# EAGLE design SD2IEC (EAGLE 6.6.0)
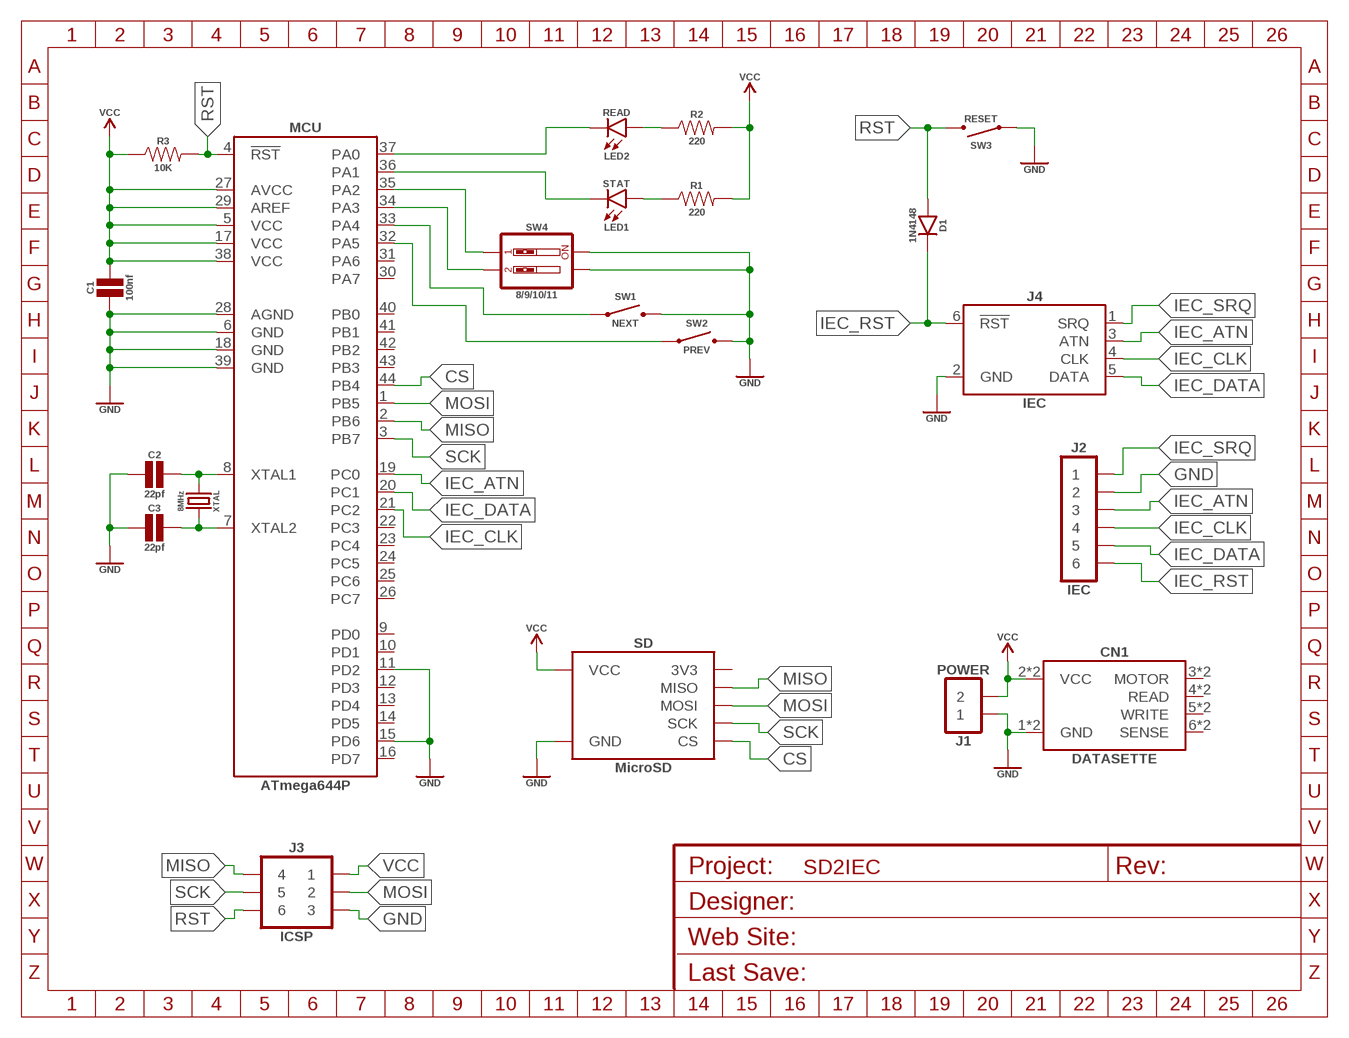
[diagram p0: schematic, sheet 1]
FRAME1 (A5L_FRAME): DESIGNER: Simon/CGTr; REVISION: 1.0; WEBSITE: http://www.commodore.gen.tr

## Parts
C1  100nf  CAPACITOR_CERAMIC_1206  [CAPACITOR_CERAMIC_1206]
C2  22pf  CAPACITOR_CERAMIC_1206  [CAPACITOR_CERAMIC_1206]
C3  22pf  CAPACITOR_CERAMIC_1206  [CAPACITOR_CERAMIC_1206]
CN1  DATASETTE  C64_DATASETTE_PADS  [C64_DATASETTE_PADS]
D1  1N4148  DIODE_NORMAL_LL4148  [DIODE_NORMAL_SMT]
J1  POWER  HDR_1X02  [HDR_1X02]
J2  IEC  HDR_1X06  [HDR_1X06]
J3  ICSP  HDR_2X03  [HDR_2X03]
J4  IEC  C64_IEC  [C64_IEC_DIN6]
LED1  STAT  LED_NORMAL_1206  [LED_1206]
LED2  READ  LED_NORMAL_1206  [LED_1206]
MCU  ATmega644P  ATMEGA644P-20AU  [TQFP44]
R1  220  RESISTOR_SMT_1206  [RESISTOR_1206]
R2  220  RESISTOR_SMT_1206  [RESISTOR_1206]
R3  10K  RESISTOR_SMT_1206  [RESISTOR_1206]
SD  MicroSD  MICROSD_RTL  [MICROSD_RTL]
SW1  NEXT  SWITCH_THT_SIDE  [SWITCH_THT_SIDE]
SW2  PREV  SWITCH_THT_SIDE  [SWITCH_THT_SIDE]
SW3  RESET  SWITCH_THT_SIDE  [SWITCH_THT_SIDE]
SW4  8/9/10/11  SWITCH_DIP_02  [SWITCH_DIP_02]
XTAL  8MHz  XTAL_5032  [XTAL_5032]

## Nets
8/9: MCU.35(PA2) SW4.1
10/11: MCU.34(PA3) SW4.2
CS: MCU.44(PB4) SD.CS
GND: C1.1 C2.1 C3.1 CN1.1(GND) CN1.A(GND) J1.1 J2.2 J3.3 J4.2(GND) MCU.6(GND) MCU.11(PD2) MCU.15(PD6) MCU.18(GND) MCU.28(AGND) MCU.39(GND) SD.GND SW1.2 SW2.2 SW3.1 SW4.3 SW4.4
IEC_ATN: J2.3 J4.3(ATN) MCU.19(PC0)
IEC_CLK: J2.4 J4.4(CLK) MCU.21(PC2)
IEC_DATA: J2.5 J4.5(DATA) MCU.20(PC1)
IEC_RST: D1.C(CATHODE) J2.6 J4.6(!RST)
IEC_SRQ: J2.1 J4.1(SRQ)
MISO: J3.4 MCU.2(PB6) SD.MISO
MOSI: J3.2 MCU.1(PB5) SD.MOSI
NEXT: MCU.33(PA4) SW1.1
PREV: MCU.32(PA5) SW2.1
READ: LED2.C MCU.37(PA0)
READ1: LED2.A R2.1
RST: D1.A(ANODE) J3.6 MCU.4(!RST) R3.2 SW3.2
SCK: J3.5 MCU.3(PB7) SD.SCK
SELECT: LED1.C MCU.36(PA1)
SELECT1: LED1.A R1.1
VCC: C1.2 CN1.2(VCC) CN1.B(VCC) J1.2 J3.1 MCU.5(VCC) MCU.17(VCC) MCU.27(AVCC) MCU.29(AREF) MCU.38(VCC) R1.2 R2.2 R3.1 SD.VCC
XTAL1: C2.2 MCU.8(XTAL1) XTAL.1
XTAL2: C3.2 MCU.7(XTAL2) XTAL.2
Unconnected: CN1.3(MOTOR) CN1.4(READ) CN1.5(WRITE) CN1.6(SENSE) CN1.C(MOTOR) CN1.D(READ) CN1.E(WRITE) CN1.F(SENSE) MCU.9(PD0) MCU.10(PD1) MCU.12(PD3) MCU.13(PD4) MCU.14(PD5) MCU.16(PD7) MCU.22(PC3) MCU.23(PC4) MCU.24(PC5) MCU.25(PC6) MCU.26(PC7) MCU.30(PA7) MCU.31(PA6) MCU.40(PB0) MCU.41(PB1) MCU.42(PB2) MCU.43(PB3) SD.3V3

## Library data of the parts
C1-C3 = sj_standart:CAPACITOR_CERAMIC: Ceramic Capacitor
CN1 = sj_commodore:C64_DATASETTE: C64 Datasette Pads
D1 = sj_standart:DIODE_NORMAL: Standart Small Signal and Rectifier Diodes
J1 = sj_connectors:HDR_1X02: 1x02 - 0.1" Pin Header
J2 = sj_connectors:HDR_1X06: 1x06 - 0.1" Pin Header
J3 = sj_connectors:HDR_2X03: 2x03 - 0.1" Pin Header
J4 = sj_commodore:C64_IEC: C64 IEC Connector
LED1 LED2 = sj_standart:LED_NORMAL: Standard LED
MCU = sj_mcu:ATMEGA644P: ATmega644P MCU - 64 KB FLASH, 4 KB SRAM, 2 KB EEPROM
R1-R3 = sj_standart:RESISTOR: Resistor
SD = sj_arduino:MICROSD: MicroSD Card Module
SW1-SW3 = sj_standart:SWITCH_THT: Switch (Through Hole Technology)
SW4 = sj_standart:SWITCH_DIP_02: 2-bit DIP Switch
XTAL = sj_mcu:XTAL: Crystal Oscillator

## Board
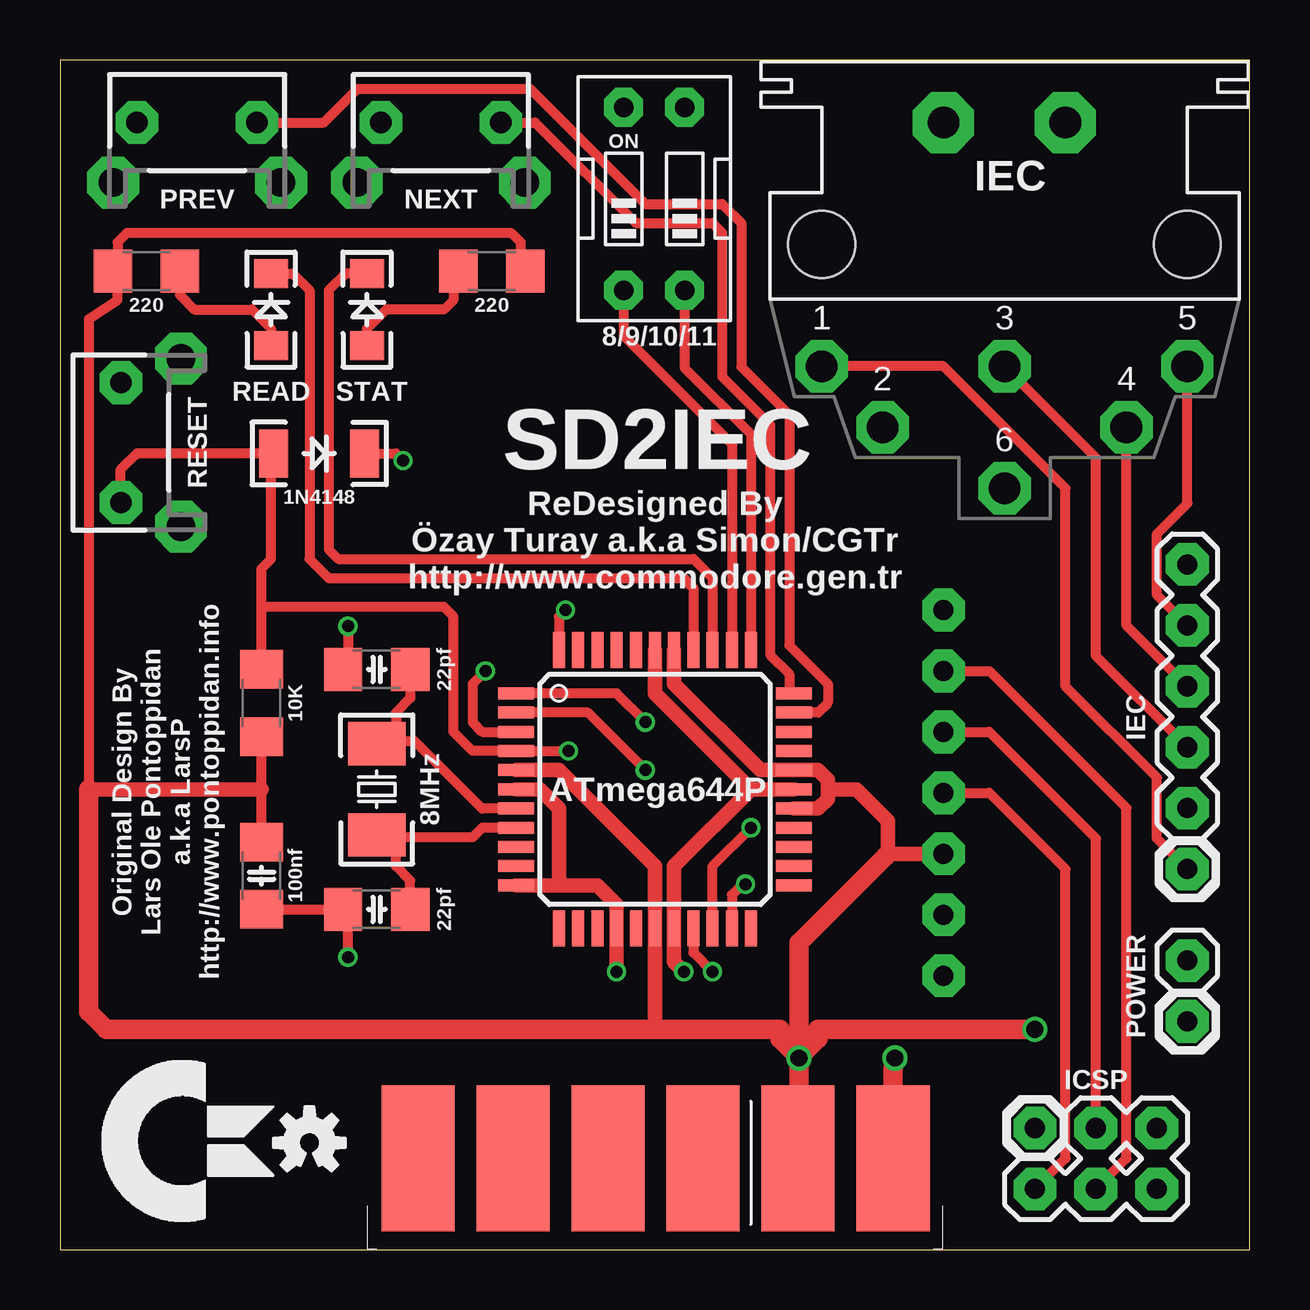
[diagram p1: board, top side]
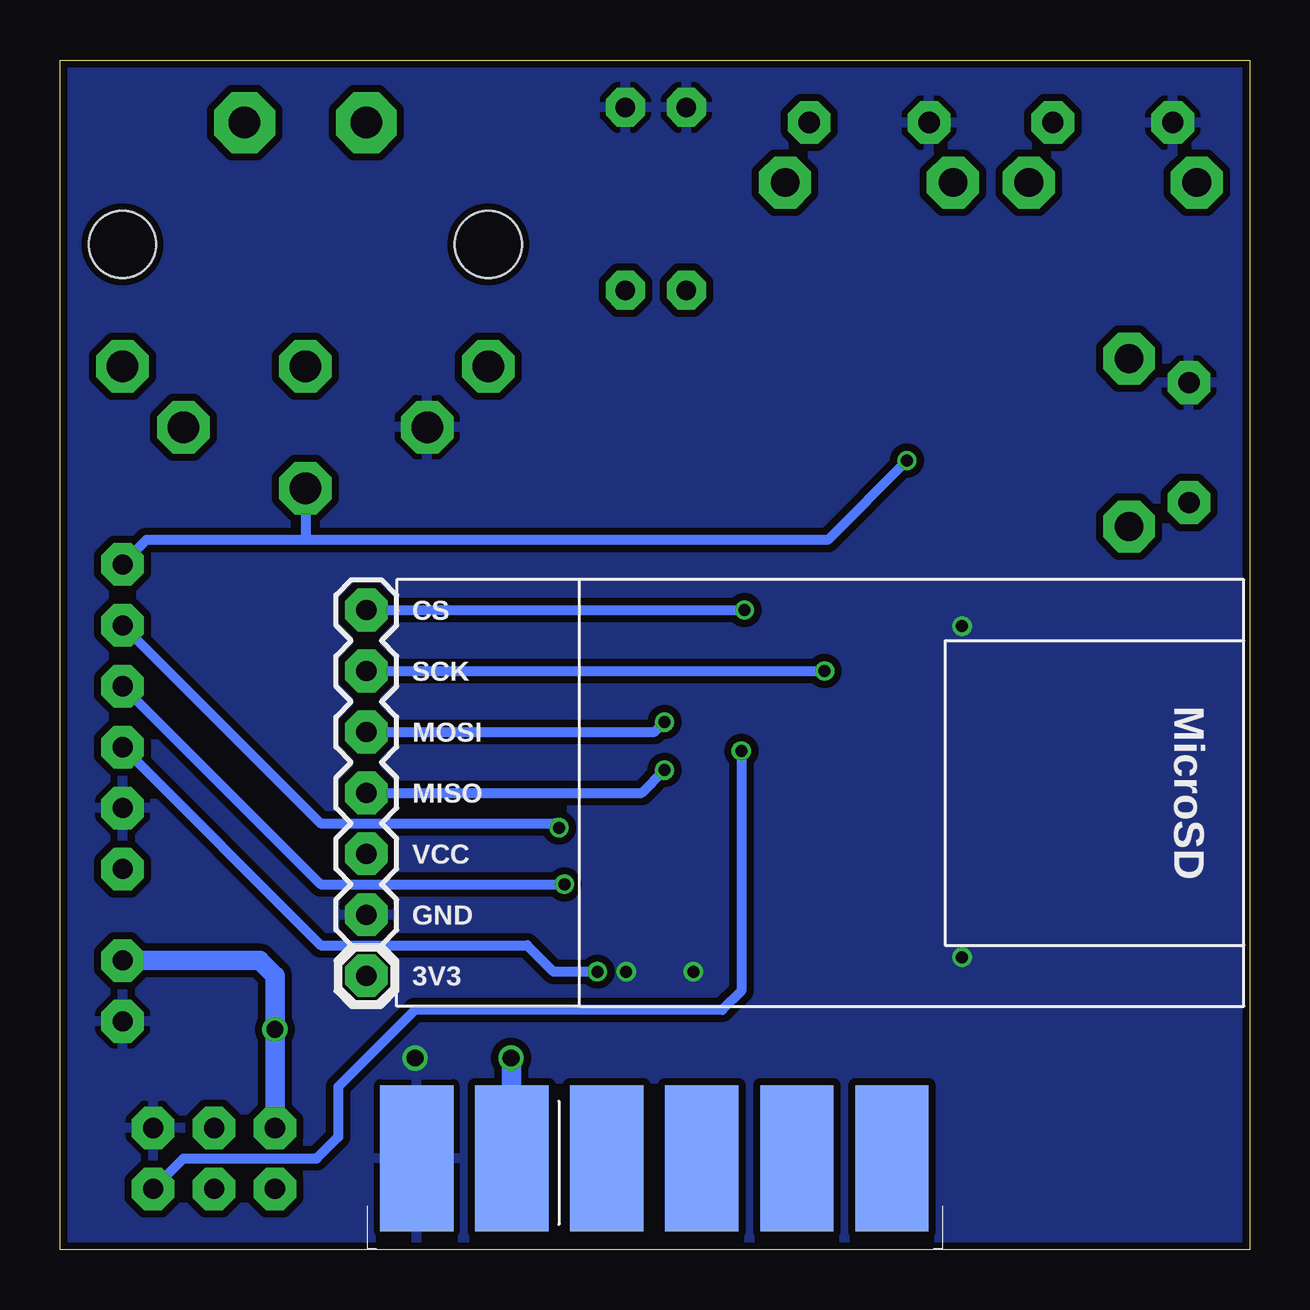
[diagram p2: board, bottom side, seen from below]

Size 49.6 x 49.6 mm. Coordinates in mm from the lower left corner, seen from the top.
Outline: 0,0 49.6,0 49.6,49.6 0,49.6 0,0
Copper layers (1*16): Top 0.035mm / dielectric 1.5mm / Bottom 0.035mm
Design rules "DirtyPCBs": minimum track width 5mil, minimum drill 12mil, track to track 5mil, track to pad 5mil, pad to pad 5mil, via to via 5mil, smd to smd 0mil, copper to edge 10mil, drill to drill 10mil, minimum pad ring 10mil, minimum via ring 6mil, stop-mask expansion 2mil, vias tented up to drill 25mil, thermal gap 10mil

### Footprints (pad centres in the part's own frame; a part is rotated, then mirrored left to right if it is on the bottom)
CAPACITOR_CERAMIC_1206 = smd 1.6 x 1.8: 1 -1.4,0; 2 1.4,0
C64_DATASETTE_PADS = smd 3.048 x 6.096: 1 9.927,-3.781; 2 5.967,-3.781; 3 2.007,-3.781; 4 -1.953,-3.781; 5 -5.913,-3.781; 6 -9.873,-3.781 | smd 3.048 x 6.096 bottom: A 9.927,-3.781; B 5.967,-3.781; C 2.007,-3.781; D -1.953,-3.781; E -5.913,-3.781; F -9.873,-3.781
DIODE_NORMAL_SMT = smd 1.2 x 2: A -1.9,0; C 1.9,0
HDR_1X02 = drill 0.838 pad 1.778 octagon: 1 0,0; 2 2.54,0
HDR_1X06 = drill 0.838 pad 1.778 octagon: 1 0,0; 2 2.54,0; 3 5.08,0; 4 7.62,0; 5 10.16,0; 6 12.7,0
HDR_2X03 = drill 0.838 pad 1.778 octagon: 1 0,0; 2 2.54,0; 3 5.08,0; 4 0,-2.54; 5 2.54,-2.54; 6 5.08,-2.54
C64_IEC_DIN6 = drill 1.321 pad 2.184 octagon: 1 7.62,5.08; 2 5.08,7.62; 3 0,5.08; 4 -5.08,7.62; 5 -7.62,5.08; 6 0,10.16 | drill 1.321 pad 2.54 octagon: PAD@1 -2.54,-5.08; PAD@2 2.54,-5.08 | hole 2.794: 7.62,0; -7.62,0
LED_1206 = smd 1.2 x 1.4: A -1.5,0; C 1.5,0
TQFP44 = smd 1.5 x 0.5: 1 -5.8,4; 2 -5.8,3.2; 3 -5.8,2.4; 4 -5.8,1.6; 5 -5.8,0.8; 6 -5.8,0; 7 -5.8,-0.8; 8 -5.8,-1.6; 9 -5.8,-2.4; 10 -5.8,-3.2; 11 -5.8,-4; 23 5.8,-4; 24 5.8,-3.2; 25 5.8,-2.4; 26 5.8,-1.6; 27 5.8,-0.8; 28 5.8,0; 29 5.8,0.8; 30 5.8,1.6; 31 5.8,2.4; 32 5.8,3.2; 33 5.8,4 | smd 0.5 x 1.5: 12 -4,-5.8; 13 -3.2,-5.8; 14 -2.4,-5.8; 15 -1.6,-5.8; 16 -0.8,-5.8; 17 0,-5.8; 18 0.8,-5.8; 19 1.6,-5.8; 20 2.4,-5.8; 21 3.2,-5.8; 22 4,-5.8; 34 4,5.8; 35 3.2,5.8; 36 2.4,5.8; 37 1.6,5.8; 38 0.8,5.8; 39 0,5.8; 40 -0.8,5.8; 41 -1.6,5.8; 42 -2.4,5.8; 43 -3.2,5.8; 44 -4,5.8
RESISTOR_1206 = smd 1.6 x 1.8: 1 -1.4,0; 2 1.4,0
MICROSD_RTL = drill 0.838 pad 1.778 octagon: 3V3 7.62,1.27; CS -7.62,1.27; GND 5.08,1.27; MISO 0,1.27; MOSI -2.54,1.27; SCK -5.08,1.27; VCC 2.54,1.27
SWITCH_THT_SIDE = drill 0.889 pad 1.778 octagon: 1 -2.5,0; 2 2.5,0 | drill 1.194 pad 2.159 octagon: ANCHOR1 -3.5,2.5; ANCHOR2 3.5,2.5
SWITCH_DIP_02 = drill 0.813 pad 1.626 octagon: 1 -1.27,-3.81; 2 1.27,-3.81; 3 1.27,3.81; 4 -1.27,3.81
XTAL_5032 = smd 1.8 x 2.4: 1 -1.9,0; 2 1.9,0

### Placement (x,y rotation side)
C1  8.4,15.6 90 top
C2  13.2,14.2 0 top
C3  13.2,24.2 0 top
CN1  24.8,7.6 0 top
D1  10.8,33.2 0 top
J1  46.99,9.53 90 top
J2  46.99,15.88 90 top
J3  40.64,5.08 0 top
J4  39.37,41.91 180 top
LED1  12.8,39.2 90 top
LED2  8.8,39.2 90 top
LOGO1  OSHW_LOGO_SMALL  [OSHW_LOGO_SMALL]  10.4,4.47 0 top
MCU  24.8,19.2 0 top
R1  18,40.8 0 top
R2  3.6,40.8 180 top
R3  8.4,22.8 90 top
SD  38.1,19.05 270 bottom
SW1  15.88,46.99 180 top
SW2  5.71,46.99 180 top
SW3  2.54,33.66 270 top
SW4  24.77,43.81 0 top
XTAL  13.2,19.2 90 top

### Tracks (layer width: path | path; a pad name or v marks a point on that pad's centre or on a via)
8/9
  Top 0.406: SW4.1 23.5,38.1 28,33.6 MCU.35
10/11
  Top 0.406: SW4.2 26.04,36.77 28.8,34 MCU.34
CS  (via drill 0.5)
  Top 0.406: v21.07,26.67 20.8,26.4 MCU.44
  Bottom 0.406: SD.CS v21.07,26.67
GND  (via drill 0.5, 0.7)
  Top 0.406: C1.1 C2.1 12,14 v12,12.2 | v12,26 12,24.4 C3.1
  Top 0.61: MCU.28 28.8,19.2 | 28.8,19.2 25.6,16 MCU.18 25.6,12 v26,11.6 | 28.8,19.2 24.8,23.2 MCU.39 | v23.2,11.6 MCU.15 23.2,14.4 22.4,15.2 20.8,15.2 | MCU.6 20,19.2 20.8,18.4 20.8,15.2 | 20.8,15.2 MCU.11
  Top 0.813: CN1.1 34.73,7.53 v34.8,8
  pour Bottom (isolate 0.305): 0,49.6 49.6,49.6 49.6,0 0,0
IEC_ATN  (via drill 0.5)
  Top 0.406: MCU.19 26.4,12.4 v27.2,11.6 | J2.3 43.18,24.77 43.18,33.02 J4.3
  Bottom 0.406: J2.3 38.73,12.7 30.12,12.7 29.02,11.6 v27.2,11.6
IEC_CLK  (via drill 0.5)
  Top 0.406: v28.57,15.24 28.44,15.24 28,14.8 MCU.21 | J2.4 44.45,26.04 J4.4
  Bottom 0.406: J2.4 38.73,15.24 v28.57,15.24
IEC_DATA  (via drill 0.5)
  Top 0.406: MCU.20 27.2,16 v28.8,17.6 | J2.5 45.72,27.3 45.72,29.84 46.99,31.11 J4.5
  Bottom 0.406: J2.5 38.73,17.78 28.98,17.78 v28.8,17.6
IEC_RST  (via drill 0.5)
  Top 0.406: D1.C 14,33.2 v14.3,32.9
  Bottom 0.406: 39.37,29.6 17.6,29.6 v14.3,32.9 | 39.37,29.6 46,29.6 46.99,28.61 J2.6 | J4.6 39.37,29.6
IEC_SRQ
  Top 0.406: J2.1 45.72,17.14 45.72,19.68 41.91,23.5 41.91,31.75 36.83,36.83 J4.1
MISO  (via drill 0.5)
  Top 0.406: v24.4,20 22,22.4 MCU.2 | SD.MISO 38.73,19.05 41.91,15.88 41.91,3.81 J3.4
  Bottom 0.406: SD.MISO 25.35,19.05 v24.4,20
MOSI  (via drill 0.5)
  Top 0.406: v24.4,22 23.2,23.2 MCU.1 | SD.MOSI 38.73,21.59 43.18,17.14 J3.2
  Bottom 0.406: SD.MOSI 24.81,21.59 v24.4,22
NEXT
  Top 0.406: SW1.1 19.81,46.99 24,42.8 27.2,42.8 27.6,42.4 27.6,36.4 29.6,34.4 29.6,24.8 30.4,24 30.4,23.4 MCU.33
PREV
  Top 0.406: SW2.1 10.99,46.99 12.4,48.4 19.6,48.4 24.4,43.6 27.6,43.6 28.4,42.8 28.4,36.8 30.4,34.8 30.4,25.2 32,23.6 32,22.8 31.6,22.4 MCU.32
READ
  Top 0.406: LED2.C 9.7,40.7 10.4,40 10.4,28.8 11.2,28 26,28 26.4,27.6 MCU.37
READ1
  Top 0.406: R2.1 5,39.8 5.6,39.2 8,39.2 8.8,38.4 LED2.A
RST  (via drill 0.5)
  Top 0.406: R3.2 8.4,26.8 | 8.4,26.8 8.4,28.4 8.8,28.8 8.8,33.1 D1.A 3.2,33.2 2.54,32.54 SW3.2 | 8.4,26.8 16,26.8 16.4,26.4 16.4,21.6 17.2,20.8 MCU.4 v21.2,20.8
  Bottom 0.406: J3.6 44.45,3.81 38.9,3.81 38,4.71 38,6.8 34.8,10 22,10 21.2,10.8 v21.2,20.8
SCK  (via drill 0.5)
  Top 0.406: v17.73,24.13 17.2,23.6 17.2,22 17.6,21.6 MCU.3 | SD.SCK 38.73,24.13 44.45,18.41 44.45,3.81 J3.5
  Bottom 0.406: SD.SCK v17.73,24.13
SELECT
  Top 0.406: LED1.C 11.9,40.7 11.2,40 11.2,29.2 11.6,28.8 26.4,28.8 27.2,28 MCU.36
SELECT1
  Top 0.406: R1.1 16.6,40.2 16.4,40 16.4,39.6 16,39.2 13.6,39.2 12.8,38.4 LED1.A
VCC  (via drill 0.7)
  Top 0.406: C1.2 8.4,19.2 R3.1 | R1.2 19.2,41 19.2,42 18.8,42.4 2.8,42.4 2.4,42 2.4,41 R2.2 2.4,40.6 2.4,39.6 1.2,38.8 1.2,19.2 | 30.8,3.85 CN1.2 | 34.51,16.51 34.4,16.4
  Top 0.61: MCU.38 25.6,23.6 29.2,20 MCU.29 31.6,20 32,19.6 32,19.2 | MCU.5 20.8,20 24.8,16 MCU.17 24.8,9.2 | SD.VCC 34.51,16.51 34.51,17.89 33.2,19.2 32,19.2 | 8.4,19.2 1.2,19.2 | 32,19.2 32,18.8 31.6,18.4 MCU.27
  Top 0.813: 1.2,19.2 1.2,9.93 1.93,9.2 24.8,9.2 30,9.2 30,8.8 v30.8,8 | 34.4,16.4 30.8,12.8 v30.8,8 | v30.8,8 30.8,3.85 | v40.64,9.2 31.6,9.2 31.6,8.8 v30.8,8
  Bottom 0.406: 30.77,7.97 v30.8,8
  Bottom 0.813: CN1.2 30.77,7.97 | J3.1 v40.64,9.2 40.64,11.43 41.27,12.06 J1.2
XTAL1
  Top 0.406: MCU.8 17.6,17.6 17.2,17.2 14,17.2 | 14,17.2 13.3,17.2 XTAL.1 | C2.2 14.6,15.4 14,16 14,17.2
XTAL2
  Top 0.406: C3.2 14.6,23 14,22.4 14,21.2 | MCU.7 17.6,18.4 14.8,21.2 14,21.2 | 14,21.2 13.3,21.2 XTAL.2

### Text on the board
tPlace: SD2IEC | ReDesigned By / Özay Turay a.k.a Simon/CGTr / http://www.commodore.gen.tr | Original Design By / Lars Ole Pontoppidan / a.k.a LarsP / http://www.pontoppidan.info